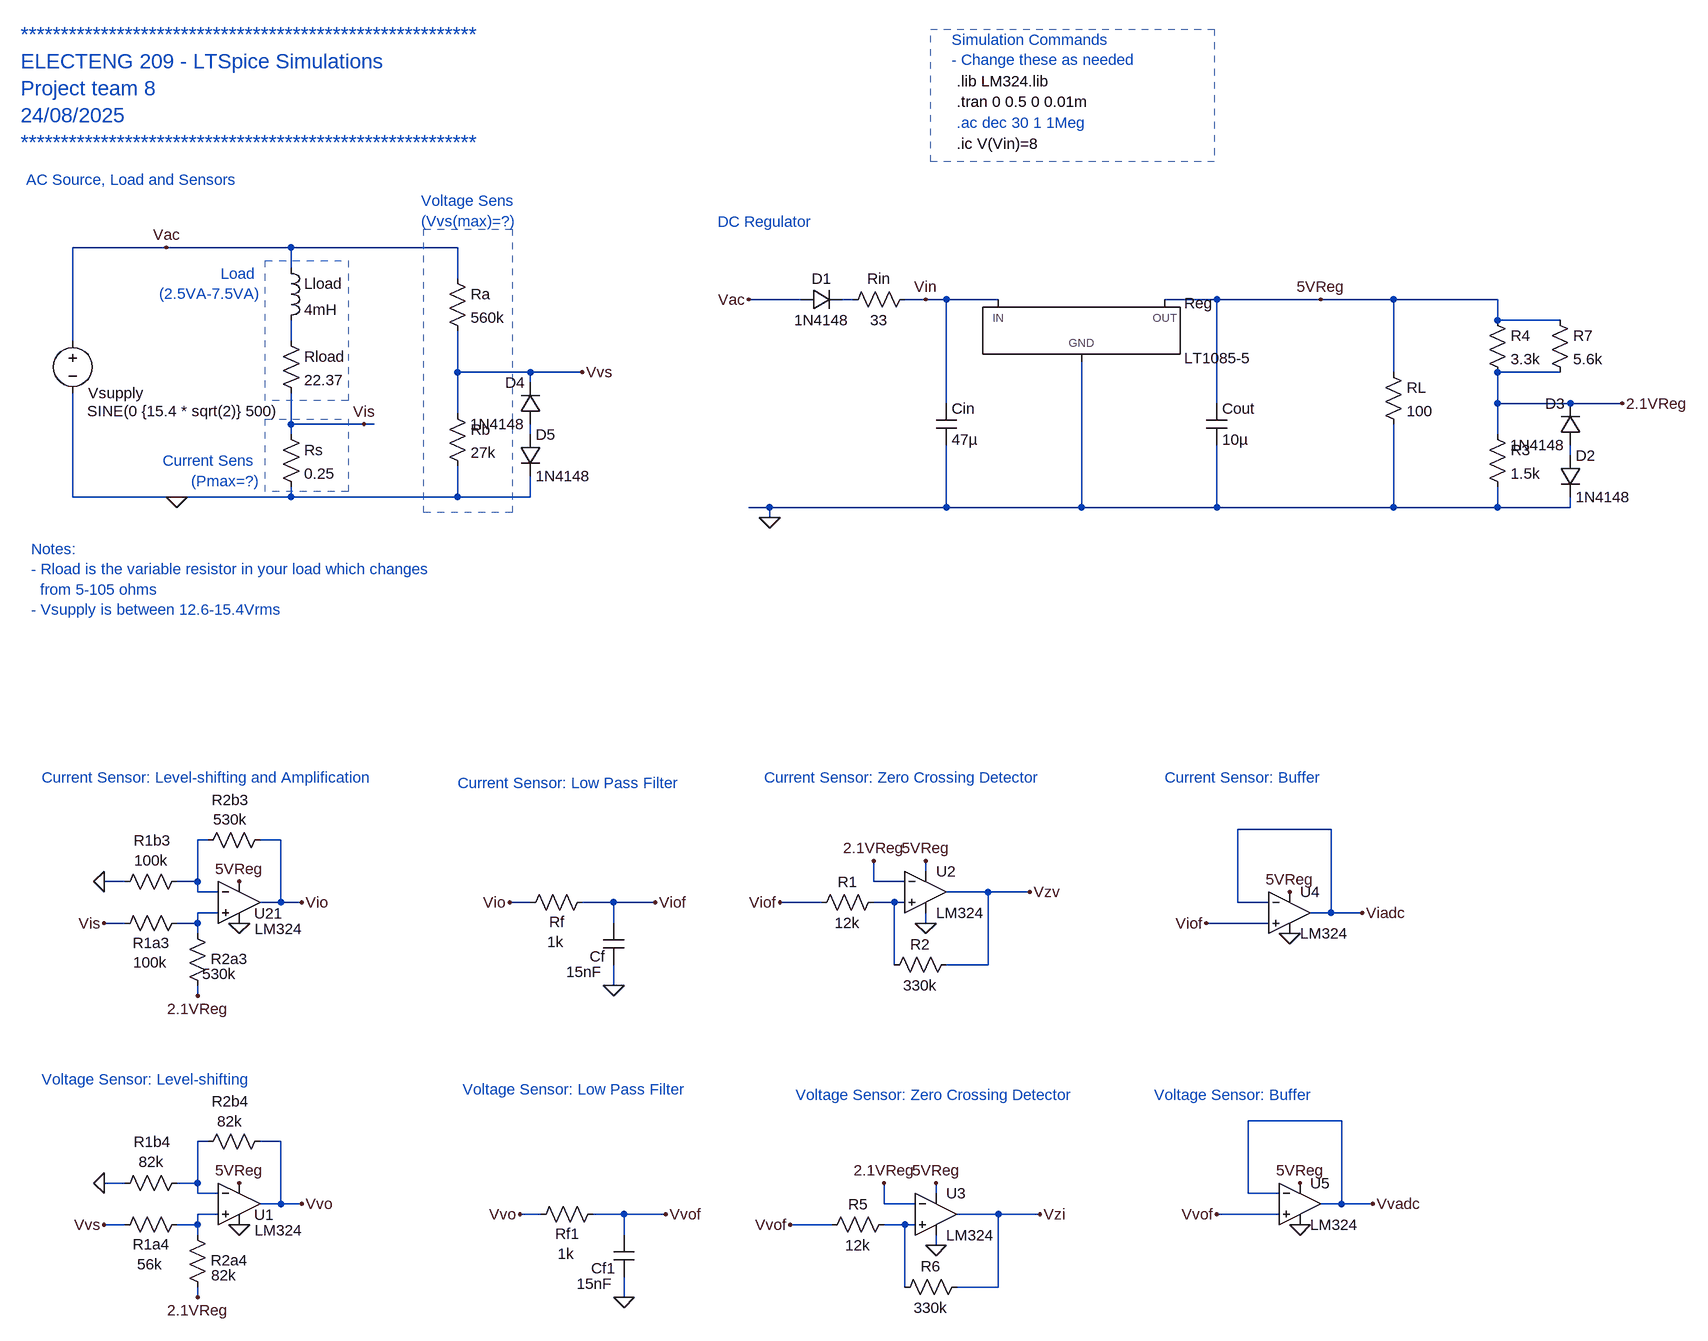
[diagram p0: schematic Project_Model.asc]
Project_Model.asc, the LTspice schematic file:
Version 4.1
SHEET 1 1984 2980
WIRE -560 112 -704 112
WIRE -368 112 -560 112
WIRE -112 112 -368 112
WIRE -368 144 -368 112
WIRE -112 160 -112 112
WIRE 416 192 336 192
WIRE 496 192 480 192
WIRE 608 192 576 192
WIRE 640 192 608 192
WIRE 720 192 640 192
WIRE 1056 192 976 192
WIRE 1216 192 1056 192
WIRE 1328 192 1216 192
WIRE 1488 192 1328 192
WIRE 1488 224 1488 192
WIRE 1584 224 1488 224
WIRE -704 256 -704 112
WIRE -368 256 -368 224
WIRE -112 304 -112 240
WIRE 0 304 -112 304
WIRE 80 304 0 304
WIRE 1328 304 1328 192
WIRE 1584 304 1488 304
WIRE 0 320 0 304
WIRE 640 352 640 192
WIRE 1056 352 1056 192
WIRE 1488 352 1488 304
WIRE 1600 352 1488 352
WIRE 1680 352 1600 352
WIRE -112 368 -112 304
WIRE -368 384 -368 336
WIRE -256 384 -368 384
WIRE -240 384 -256 384
WIRE -368 400 -368 384
WIRE 0 400 0 384
WIRE 1488 400 1488 352
WIRE 1600 432 1600 416
WIRE -704 496 -704 336
WIRE -544 496 -704 496
WIRE -368 496 -368 480
WIRE -368 496 -544 496
WIRE -112 496 -112 448
WIRE -112 496 -368 496
WIRE 0 496 0 464
WIRE 0 496 -112 496
WIRE 368 512 336 512
WIRE 640 512 640 416
WIRE 640 512 368 512
WIRE 848 512 848 288
WIRE 848 512 640 512
WIRE 1056 512 1056 416
WIRE 1056 512 848 512
WIRE 1328 512 1328 384
WIRE 1328 512 1056 512
WIRE 1488 512 1488 480
WIRE 1488 512 1328 512
WIRE 1600 512 1600 496
WIRE 1600 512 1488 512
WIRE 368 528 368 512
WIRE 1232 1008 1088 1008
WIRE -496 1024 -512 1024
WIRE -384 1024 -416 1024
WIRE 608 1072 608 1056
WIRE -624 1088 -656 1088
WIRE -512 1088 -512 1024
WIRE -512 1088 -544 1088
WIRE 528 1088 528 1056
WIRE 576 1088 528 1088
WIRE -512 1104 -512 1088
WIRE -480 1104 -512 1104
WIRE 704 1104 640 1104
WIRE 768 1104 704 1104
WIRE -384 1120 -384 1024
WIRE -384 1120 -416 1120
WIRE -352 1120 -384 1120
WIRE 0 1120 -32 1120
WIRE 128 1120 80 1120
WIRE 192 1120 128 1120
WIRE 448 1120 384 1120
WIRE 560 1120 528 1120
WIRE 576 1120 560 1120
WIRE 1088 1120 1088 1008
WIRE 1136 1120 1088 1120
WIRE -480 1136 -512 1136
WIRE 1232 1136 1232 1008
WIRE 1232 1136 1200 1136
WIRE 1280 1136 1232 1136
WIRE -624 1152 -656 1152
WIRE -512 1152 -512 1136
WIRE -512 1152 -544 1152
WIRE 128 1152 128 1120
WIRE 608 1152 608 1136
WIRE 1136 1152 1040 1152
WIRE -512 1168 -512 1152
WIRE 560 1216 560 1120
WIRE 704 1216 704 1104
WIRE 704 1216 640 1216
WIRE 128 1248 128 1216
WIRE -512 1264 -512 1248
WIRE 1248 1456 1104 1456
WIRE -496 1488 -512 1488
WIRE -384 1488 -416 1488
WIRE -624 1552 -656 1552
WIRE -512 1552 -512 1488
WIRE -512 1552 -544 1552
WIRE -512 1568 -512 1552
WIRE -480 1568 -512 1568
WIRE 624 1568 624 1552
WIRE 1104 1568 1104 1456
WIRE 1152 1568 1104 1568
WIRE -384 1584 -384 1488
WIRE -384 1584 -416 1584
WIRE -352 1584 -384 1584
WIRE 544 1584 544 1552
WIRE 592 1584 544 1584
WIRE 1248 1584 1248 1456
WIRE 1248 1584 1216 1584
WIRE 1296 1584 1248 1584
WIRE -480 1600 -512 1600
WIRE 16 1600 -16 1600
WIRE 144 1600 96 1600
WIRE 208 1600 144 1600
WIRE 720 1600 656 1600
WIRE 784 1600 720 1600
WIRE 1152 1600 1056 1600
WIRE -624 1616 -656 1616
WIRE -512 1616 -512 1600
WIRE -512 1616 -544 1616
WIRE 464 1616 400 1616
WIRE 576 1616 544 1616
WIRE 592 1616 576 1616
WIRE -512 1632 -512 1616
WIRE 144 1632 144 1600
WIRE 624 1648 624 1632
WIRE 576 1712 576 1616
WIRE 720 1712 720 1600
WIRE 720 1712 656 1712
WIRE -512 1728 -512 1712
WIRE 144 1728 144 1696
FLAG -544 496 0
FLAG -560 112 Vac
FLAG 368 528 0
FLAG -256 384 Vis
FLAG 80 304 Vvs
FLAG -448 1152 0
FLAG -448 1088 5VReg
FLAG -656 1152 Vis
FLAG -656 1088 0
FLAG -352 1120 Vio
FLAG -448 1616 0
FLAG -448 1552 5VReg
FLAG -656 1616 Vvs
FLAG -656 1552 0
FLAG -352 1584 Vvo
FLAG 336 192 Vac
FLAG 1216 192 5VReg
FLAG 128 1248 0
FLAG -32 1120 Vio
FLAG 192 1120 Viof
FLAG 608 192 Vin
FLAG 608 1056 5VReg
FLAG 144 1728 0
FLAG -16 1600 Vvo
FLAG 208 1600 Vvof
FLAG 624 1552 5VReg
FLAG 384 1120 Viof
FLAG 400 1616 Vvof
FLAG 768 1104 Vzv
FLAG 784 1600 Vzi
FLAG -512 1264 2.1VReg
FLAG -512 1728 2.1VReg
FLAG 608 1152 0
FLAG 624 1648 0
FLAG 528 1056 2.1VReg
FLAG 544 1552 2.1VReg
FLAG 1680 352 2.1VReg
FLAG 1168 1104 5VReg
FLAG 1168 1168 0
FLAG 1040 1152 Viof
FLAG 1280 1136 Viadc
FLAG 1184 1552 5VReg
FLAG 1184 1616 0
FLAG 1296 1584 Vvadc
FLAG 1056 1600 Vvof
SYMBOL voltage -704 240 R0
WINDOW 0 24 96 Left 2
WINDOW 3 22 124 Left 2
WINDOW 123 0 0 Left 0
WINDOW 39 0 0 Left 0
SYMATTR InstName Vsupply
SYMATTR Value SINE(0 {15.4 * sqrt(2)} 500)
SYMBOL PowerProducts/LT1085-5 848 192 R0
SYMATTR InstName Reg
SYMBOL res 1312 288 R0
SYMATTR InstName RL
SYMATTR Value 100
SYMBOL res 592 176 R90
WINDOW 0 0 56 VBottom 2
WINDOW 3 32 56 VTop 2
SYMATTR InstName Rin
SYMATTR Value 33
SYMBOL diode 416 208 R270
WINDOW 0 32 32 VTop 2
WINDOW 3 0 32 VBottom 2
SYMATTR InstName D1
SYMATTR Value 1N4148
SYMBOL cap 624 352 R0
SYMATTR InstName Cin
SYMATTR Value 47µ
SYMATTR SpiceLine Rser=0.001
SYMBOL cap 1040 352 R0
SYMATTR InstName Cout
SYMATTR Value 10µ
SYMATTR SpiceLine Rser=0.001
SYMBOL res -384 240 R0
SYMATTR InstName Rload
SYMATTR Value 22.37
SYMBOL ind -384 128 R0
SYMATTR InstName Lload
SYMATTR Value 4mH
SYMBOL res -384 384 R0
SYMATTR InstName Rs
SYMATTR Value 0.25
SYMBOL res -128 144 R0
SYMATTR InstName Ra
SYMATTR Value 560k
SYMBOL res -128 352 R0
SYMATTR InstName Rb
SYMATTR Value 27k
SYMBOL Opamps/opamp2 -448 1056 R0
WINDOW 0 23 81 Left 2
WINDOW 3 24 105 Left 2
SYMATTR InstName U21
SYMATTR Value LM324
SYMBOL res -528 1136 R90
WINDOW 0 62 55 VBottom 2
WINDOW 3 61 57 VTop 2
SYMATTR InstName R1a3
SYMATTR Value 100k
SYMBOL res -528 1072 R90
WINDOW 0 -32 53 VBottom 2
WINDOW 3 -32 55 VTop 2
SYMATTR InstName R1b3
SYMATTR Value 100k
SYMBOL res -400 1008 R90
WINDOW 0 -30 61 VBottom 2
WINDOW 3 -31 62 VTop 2
SYMATTR InstName R2b3
SYMATTR Value 530k
SYMBOL res -496 1264 R180
WINDOW 0 -62 57 Left 2
WINDOW 3 -44 34 Left 2
SYMATTR InstName R2a3
SYMATTR Value 530k
SYMBOL Opamps/opamp2 -448 1520 R0
WINDOW 0 23 81 Left 2
WINDOW 3 24 105 Left 2
SYMATTR InstName U1
SYMATTR Value LM324
SYMBOL res -528 1600 R90
WINDOW 0 62 55 VBottom 2
WINDOW 3 61 57 VTop 2
SYMATTR InstName R1a4
SYMATTR Value 56k
SYMBOL res -528 1536 R90
WINDOW 0 -32 53 VBottom 2
WINDOW 3 -32 55 VTop 2
SYMATTR InstName R1b4
SYMATTR Value 82k
SYMBOL res -400 1472 R90
WINDOW 0 -30 61 VBottom 2
WINDOW 3 -31 62 VTop 2
SYMATTR InstName R2b4
SYMATTR Value 82k
SYMBOL res -496 1728 R180
WINDOW 0 -62 57 Left 2
WINDOW 3 -44 34 Left 2
SYMATTR InstName R2a4
SYMATTR Value 82k
SYMBOL res 96 1104 R90
WINDOW 0 62 55 VBottom 2
WINDOW 3 61 57 VTop 2
SYMATTR InstName Rf
SYMATTR Value 1k
SYMBOL cap 144 1216 R180
WINDOW 0 29 13 Left 2
WINDOW 3 33 -11 Left 2
SYMATTR InstName Cf
SYMATTR Value 15nF
SYMBOL OpAmps\\opamp2 608 1040 R0
SYMATTR InstName U2
SYMATTR Value LM324
SYMBOL res 544 1104 R90
WINDOW 0 0 56 VBottom 2
WINDOW 3 32 56 VTop 2
SYMATTR InstName R1
SYMATTR Value 12k
SYMBOL res 656 1200 R90
WINDOW 0 0 56 VBottom 2
WINDOW 3 32 56 VTop 2
SYMATTR InstName R2
SYMATTR Value 330k
SYMBOL res 1472 384 R0
SYMATTR InstName R3
SYMATTR Value 1.5k
SYMBOL res 1472 208 R0
SYMATTR InstName R4
SYMATTR Value 3.3k
SYMBOL diode 1584 432 R0
SYMATTR InstName D2
SYMATTR Value 1N4148
SYMBOL diode 1616 416 R180
WINDOW 0 24 64 Left 2
WINDOW 3 24 0 Left 2
SYMATTR InstName D3
SYMATTR Value 1N4148
SYMBOL res 112 1584 R90
WINDOW 0 62 55 VBottom 2
WINDOW 3 61 57 VTop 2
SYMATTR InstName Rf1
SYMATTR Value 1k
SYMBOL cap 160 1696 R180
WINDOW 0 29 13 Left 2
WINDOW 3 33 -11 Left 2
SYMATTR InstName Cf1
SYMATTR Value 15nF
SYMBOL OpAmps\\opamp2 624 1536 R0
SYMATTR InstName U3
SYMATTR Value LM324
SYMBOL res 560 1600 R90
WINDOW 0 0 56 VBottom 2
WINDOW 3 32 56 VTop 2
SYMATTR InstName R5
SYMATTR Value 12k
SYMBOL res 672 1696 R90
WINDOW 0 0 56 VBottom 2
WINDOW 3 32 56 VTop 2
SYMATTR InstName R6
SYMATTR Value 330k
SYMBOL diode 16 384 R180
WINDOW 0 24 64 Left 2
WINDOW 3 24 0 Left 2
SYMATTR InstName D4
SYMATTR Value 1N4148
SYMBOL diode -16 400 R0
SYMATTR InstName D5
SYMATTR Value 1N4148
SYMBOL OpAmps\\opamp2 1168 1072 R0
SYMATTR InstName U4
SYMATTR Value LM324
SYMBOL OpAmps\\opamp2 1184 1520 R0
SYMATTR InstName U5
SYMATTR Value LM324
SYMBOL res 1568 208 R0
SYMATTR InstName R7
SYMATTR Value 5.6k
TEXT 656 -80 Left 2 ;.ac dec 30 1 1Meg
TEXT 656 -144 Left 2 !.lib LM324.lib
TEXT -784 -216 Left 3 ;*********************************************************\nELECTENG 209 - LTSpice Simulations\nProject team 8\n24/08/2025\n*********************************************************
TEXT -776 8 Left 2 ;AC Source, Load and Sensors
TEXT -768 576 Left 2 ;Notes: \n- Rload is the variable resistor in your load which changes \n  from 5-105 ohms \n- Vsupply is between 12.6-15.4Vrms
TEXT -416 152 Right 2 ;Load \n(2.5VA-7.5VA)
TEXT -416 440 Right 2 ;Current Sens \n(Pmax=?)
TEXT -168 40 Left 2 ;Voltage Sens\n(Vvs(max)=?)
TEXT 648 -208 Left 2 ;Simulation Commands\n- Change these as needed
TEXT -752 928 Left 2 ;Current Sensor: Level-shifting and Amplification
TEXT -752 1392 Left 2 ;Voltage Sensor: Level-shifting
TEXT 288 72 Left 2 ;DC Regulator
TEXT 656 -112 Left 2 !.tran 0 0.5 0 0.01m
TEXT 656 -48 Left 2 !.ic V(Vin)=8
TEXT -112 936 Left 2 ;Current Sensor: Low Pass Filter
TEXT -104 1408 Left 2 ;Voltage Sensor: Low Pass Filter
TEXT 360 928 Left 2 ;Current Sensor: Zero Crossing Detector
TEXT 408 1416 Left 2 ;Voltage Sensor: Zero Crossing Detector
TEXT 976 928 Left 2 ;Current Sensor: Buffer
TEXT 960 1416 Left 2 ;Voltage Sensor: Buffer
RECTANGLE Normal -408 132 -280 348 2
RECTANGLE Normal -408 376 -280 488 2
RECTANGLE Normal -164 84 -28 520 2
RECTANGLE Normal 616 -224 1052 -20 2

The netlist it stands for:
* Project_Model.asc
Vsupply Vac 0 SINE(0 {15.4 * sqrt(2)} 500)
X§Reg 0 5VReg Vin LT1085-5  ; pins GND OUT IN
RL 5VReg 0 100
Rin Vin N001 33
D1 Vac N001 1N4148
Cin Vin 0 47µ Rser=0.001
Cout 5VReg 0 10µ Rser=0.001
Rload N002 Vis 22.37
Lload Vac N002 4mH
Rs Vis 0 0.25
Ra Vac Vvs 560k
Rb Vvs 0 27k
X§U21 N007 N005 5VReg 0 Vio LM324  ; pins In+ In- V+ V- OUT
R1a3 N007 Vis 100k
R1b3 N005 0 100k
R2b3 Vio N005 530k
R2a3 2.1VReg N007 530k
X§U1 N009 N008 5VReg 0 Vvo LM324  ; pins In+ In- V+ V- OUT
R1a4 N009 Vvs 56k
R1b4 N008 0 82k
R2b4 Vvo N008 82k
R2a4 2.1VReg N009 82k
Rf Viof Vio 1k
Cf 0 Viof 15nF
X§U2 N006 2.1VReg 5VReg 0 Vzv LM324  ; pins In+ In- V+ V- OUT
R1 N006 Viof 12k
R2 Vzv N006 330k
R3 2.1VReg 0 1.5k
R4 5VReg 2.1VReg 3.3k
D2 N004 0 1N4148
D3 N004 2.1VReg 1N4148
Rf1 Vvof Vvo 1k
Cf1 0 Vvof 15nF
X§U3 N010 2.1VReg 5VReg 0 Vzi LM324  ; pins In+ In- V+ V- OUT
R5 N010 Vvof 12k
R6 Vzi N010 330k
D4 N003 Vvs 1N4148
D5 N003 0 1N4148
X§U4 Viof Viadc 5VReg 0 Viadc LM324  ; pins In+ In- V+ V- OUT
X§U5 Vvof Vvadc 5VReg 0 Vvadc LM324  ; pins In+ In- V+ V- OUT
R7 5VReg 2.1VReg 5.6k
.model D D
.lib standard.dio
* .ac dec 30 1 1Meg
.lib LM324.lib
* *********************************************************
* ELECTENG 209 - LTSpice Simulations
* Project team 8
* 24/08/2025
* *********************************************************
* AC Source, Load and Sensors
* Notes:
* - Rload is the variable resistor in your load which changes
*   from 5-105 ohms
* - Vsupply is between 12.6-15.4Vrms
* Load
* (2.5VA-7.5VA)
* Current Sens
* (Pmax=?)
* Voltage Sens
* (Vvs(max)=?)
* Simulation Commands
* - Change these as needed
* Current Sensor: Level-shifting and Amplification
* Voltage Sensor: Level-shifting
* DC Regulator
.tran 0 0.5 0 0.01m
.ic V(Vin)=8
* Current Sensor: Low Pass Filter
* Voltage Sensor: Low Pass Filter
* Current Sensor: Zero Crossing Detector
* Voltage Sensor: Zero Crossing Detector
* Current Sensor: Buffer
* Voltage Sensor: Buffer
.backanno
.end